# Altium schematic sheet JTAG_Configuration.SchDoc: AMC FMC Carrier v4
size 420 x 297 mm; CompanyName: WUT; Organization: WUT ISE; Address1: Warsaw University of Technology; Address2: Nowowiejska 15/19 00-665 Warsaw; Address3: t.przywozki@gmail.com; Revision: 1; SheetNumber: 9; SheetTotal: 29; Project: AMC FMC Carrier v4.0.2; ModifiedBy: F. Świtakowski; CheckedDate: -; Title2: JTAG Chain; DivGrp: ISE; Designer: T. Przywozki; ModifiedDate: -; ProjectName: ADC/DAC MEZZANINE
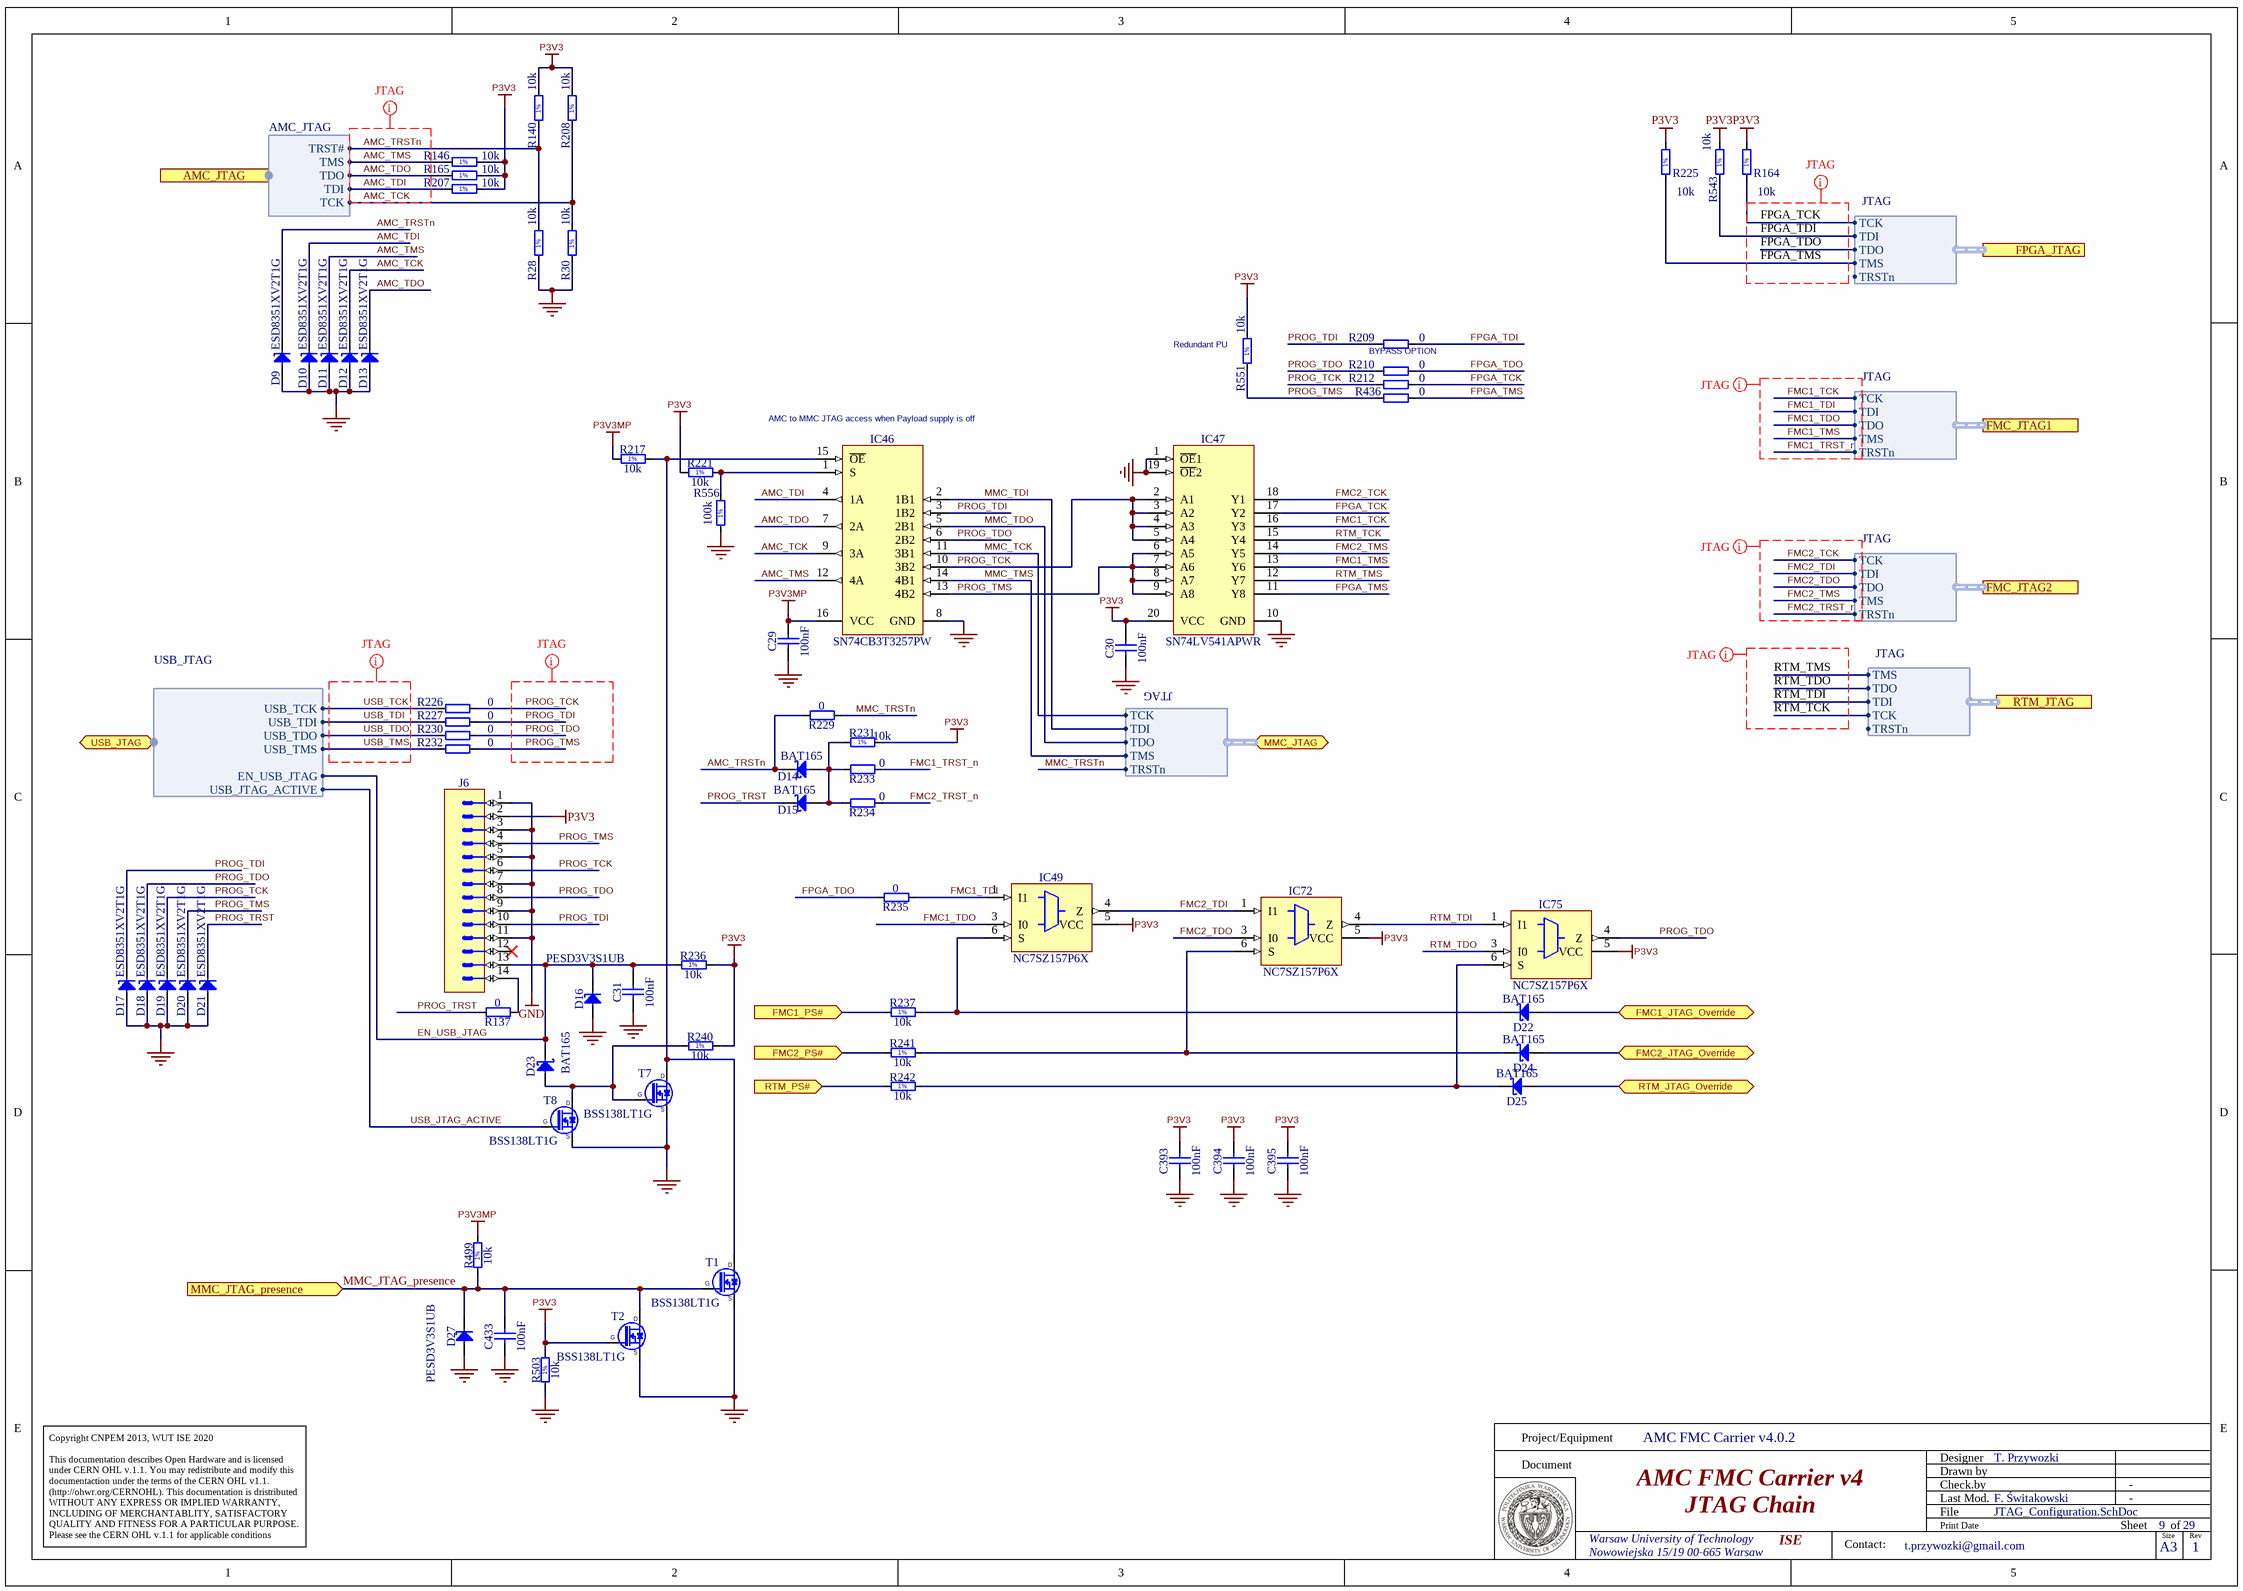
[diagram p0: JTAG_Configuration.SchDoc]

## Parts
C29  100nF  [CAPC0603X33N]
C30  100nF  [CAPC0603X33N]
C31  100nF  [CAPC1005X55N]
C393  100nF  [CAPC0603X33N]
C394  100nF  [CAPC0603X33N]
C395  100nF  [CAPC0603X33N]
C433  100nF  [CAPC1005X55N]
D9  ESD8351XV2T1G  [SODFL1608X65N]
D10  ESD8351XV2T1G  [SODFL1608X65N]
D11  ESD8351XV2T1G  [SODFL1608X65N]
D12  ESD8351XV2T1G  [SODFL1608X65N]
D13  ESD8351XV2T1G  [SODFL1608X65N]
D14  BAT165  [SOD2512X110N]
D15  BAT165  [SOD2512X110N]
D16  PESD3V3S1UB  [SODFL1608X65N]
D17  ESD8351XV2T1G  [SODFL1608X65N]
D18  ESD8351XV2T1G  [SODFL1608X65N]
D19  ESD8351XV2T1G  [SODFL1608X65N]
D20  ESD8351XV2T1G  [SODFL1608X65N]
D21  ESD8351XV2T1G  [SODFL1608X65N]
D22  BAT165  [SOD2512X110N]
D23  BAT165  [SOD2512X110N]
D24  BAT165  [SOD2512X110N]
D25  BAT165  [SOD2512X110N]
D27  PESD3V3S1UB  [SODFL1608X65N]
IC46  SN74CB3T3257PW  [SOP65P640X120-16N]
IC47  SN74LV541APWR  [SOP65P640X120-20N]
IC49  NC7SZ157P6X  [SOT65P210X110-6N]
IC72  NC7SZ157P6X  [SOT65P210X110-6N]
IC75  NC7SZ157P6X  [SOT65P210X110-6N]
J6  Milli-Grid™  [MOLEX_87832-1420]  (value not drawn)
R28  10k  [RESC1005X40N]
R30  10k  [RESC1005X40N]
R137  0  [RESC1005X40N]
R140  10k  [RESC1005X40N]
R146  10k  [RESC1005X40N]
R164  10k  [RESC1005X40N]
R165  10k  [RESC1005X40N]
R207  10k  [RESC1005X40N]
R208  10k  [RESC1005X40N]
R209  0  [RESC1005X40N]
R210  0  [RESC1005X40N]
R212  0  [RESC1005X40N]
R217  10k  [RESC1005X40N]
R221  10k  [RESC1005X40N]
R225  10k  [RESC1005X40N]
R226  0  [RESC1005X40N]
R227  0  [RESC1005X40N]
R229  0  [RESC1005X40N]
R230  0  [RESC1005X40N]
R231  10k  [RESC1005X40N]
R232  0  [RESC1005X40N]
R233  0  [RESC1005X40N]
R234  0  [RESC1005X40N]
R235  0  [RESC1005X40N]
R236  10k  [RESC1005X40N]
R237  10k  [RESC1005X40N]
R240  10k  [RESC1005X40N]
R241  10k  [RESC1005X40N]
R242  10k  [RESC1005X40N]
R436  0  [RESC1005X40N]
R499  10k  [RESC1005X40N]
R503  10k  [RESC1005X40N]
R543  10k  [RESC1005X40N]
R551  10k  [RESC1005X40N]
R556  100k  [RESC1005X40N]
T1  BSS138LT1G  [SOT95P240X110-3N]
T2  BSS138LT1G  [SOT95P240X110-3N]
T7  BSS138LT1G  [SOT95P240X110-3N]
T8  BSS138LT1G  [SOT95P240X110-3N]

## Ports
AMC_JTAG (harness AMC_JTAG), FMC1_JTAG_Override (bidir), FMC1_PS# (in), FMC2_JTAG_Override (bidir), FMC2_PS# (in), FMC_JTAG1 (harness JTAG), FMC_JTAG2 (harness JTAG), FPGA_JTAG (harness JTAG), MMC_JTAG (bidir, harness JTAG), MMC_JTAG_presence (in), RTM_JTAG (harness JTAG), RTM_JTAG_Override (bidir), RTM_PS# (in), USB_JTAG (bidir, harness USB_JTAG)

## Harnesses
AMC_JTAG: TCK, TDI, TDO, TMS, TRST#
USB_JTAG: USB_TDI, USB_TCK, USB_TMS, USB_TDO, USB_JTAG_ACTIVE, EN_USB_JTAG
JTAG: TCK, TDI, TDO, TMS, TRSTn

## Nets
GND: C29.1 C30.1 C31.1 C393.1 C394.1 C395.1 C433.1 D9.2(A) D10.2(A) D11.2(A) D12.2(A) D13.2(A) D16.2(A) D17.2(A) D18.2(A) D19.2(A) D20.2(A) D21.2(A) D27.2(A) IC46.8(GND) IC47.1(~{OE}1) IC47.10(GND) IC47.19(~{OE}2) IC49.2(GND) IC72.2(GND) IC75.2(GND) J6.1 J6.3 J6.5 J6.7 J6.9 J6.11 R28.2 R30.2 R503.1 R556.1 T1.2(S) T2.2(S) T7.2(S) T8.2(S)
P3V3: C30.2 C393.2 C394.2 C395.2 IC47.20(VCC) IC49.5(VCC) IC72.5(VCC) IC75.5(VCC) J6.2 R140.1 R146.1 R164.2 R165.1 R207.1 R208.1 R221.2 R225.2 R231.1 R236.2 R240.2 R503.2 R543.1 R551.1 T2.1(G)
P3V3MP: C29.2 IC46.16(VCC) R217.2 R499.2
AMC_TCK: D12.1(C) IC46.9(3A) R30.1 R208.2 ; port AMC_JTAG.TCK
AMC_TDI: D10.1(C) IC46.4(1A) R207.2 ; port AMC_JTAG.TDI
AMC_TDO: D13.1(C) IC46.7(2A) R165.2 ; port AMC_JTAG.TDO
AMC_TMS: D11.1(C) IC46.12(4A) R146.2 ; port AMC_JTAG.TMS
AMC_TRSTn: D9.1(C) D14.1(C) R28.1 R140.2 R229.2 ; port AMC_JTAG.TRST#
EN_USB_JTAG: C31.2 D16.1(C) D23.1(C) J6.13 R236.1 ; port USB_JTAG.EN_USB_JTAG
FMC1_JTAG_Override: D22.2(A) ; port FMC1_JTAG_Override
FMC1_PS#: R237.2 ; port FMC1_PS#
FMC1_TCK: IC47.16(Y3) ; port FMC_JTAG1.TCK
FMC1_TDI: IC49.1(I1) R235.1 ; port FMC_JTAG1.TDI
FMC1_TDO: IC49.3(I0) ; port FMC_JTAG1.TDO
FMC1_TMS: IC47.13(Y6) ; port FMC_JTAG1.TMS
FMC1_TRST_n: R233.1 ; port FMC_JTAG1.TRSTn
FMC2_JTAG_Override: D24.2(A) ; port FMC2_JTAG_Override
FMC2_PS#: R241.2 ; port FMC2_PS#
FMC2_TCK: IC47.18(Y1) ; port FMC_JTAG2.TCK
FMC2_TDI: IC49.4(Z) IC72.1(I1) ; port FMC_JTAG2.TDI
FMC2_TDO: IC72.3(I0) ; port FMC_JTAG2.TDO
FMC2_TMS: IC47.14(Y5) ; port FMC_JTAG2.TMS
FMC2_TRST_n: R234.1 ; port FMC_JTAG2.TRSTn
FPGA_TCK: IC47.17(Y2) R164.1 R212.1 ; port FPGA_JTAG.TCK
FPGA_TDI: R209.1 R543.2 ; port FPGA_JTAG.TDI
FPGA_TDO: R210.1 R235.2 ; port FPGA_JTAG.TDO
FPGA_TMS: IC47.11(Y8) R225.1 R436.1 ; port FPGA_JTAG.TMS
MMC_JTAG_presence: C433.2 D27.1(C) R499.1 T1.1(G) T2.3(D) ; port MMC_JTAG_presence
MMC_TCK: IC46.11(3B1) ; port MMC_JTAG.TCK
MMC_TDI: IC46.2(1B1) ; port MMC_JTAG.TDI
MMC_TDO: IC46.5(2B1) ; port MMC_JTAG.TDO
MMC_TMS: IC46.14(4B1) ; port MMC_JTAG.TMS
MMC_TRSTn: R229.1 ; port MMC_JTAG.TRSTn
PROG_TCK: D19.1(C) IC46.10(3B2) IC47.2(A1) IC47.3(A2) IC47.4(A3) IC47.5(A4) J6.6 R212.2 R226.1
PROG_TDI: D17.1(C) IC46.3(1B2) J6.10 R209.2 R227.1
PROG_TDO: D18.1(C) IC46.6(2B2) IC75.4(Z) J6.8 R210.2 R230.1
PROG_TMS: D20.1(C) IC46.13(4B2) IC47.6(A5) IC47.7(A6) IC47.8(A7) IC47.9(A8) J6.4 R232.1 R436.2 R551.2
PROG_TRST: D15.1(C) D21.1(C) R137.2
RTM_JTAG_Override: D25.2(A) ; port RTM_JTAG_Override
RTM_PS#: R242.2 ; port RTM_PS#
RTM_TCK: IC47.15(Y4) ; port RTM_JTAG.TCK
RTM_TDI: IC72.4(Z) IC75.1(I1) ; port RTM_JTAG.TDI
RTM_TDO: IC75.3(I0) ; port RTM_JTAG.TDO
RTM_TMS: IC47.12(Y7) ; port RTM_JTAG.TMS
USB_JTAG_ACTIVE: T8.1(G) ; port USB_JTAG.USB_JTAG_ACTIVE
USB_TCK: R226.2 ; port USB_JTAG.USB_TCK
USB_TDI: R227.2 ; port USB_JTAG.USB_TDI
USB_TDO: R230.2 ; port USB_JTAG.USB_TDO
USB_TMS: R232.2 ; port USB_JTAG.USB_TMS
NetD14_2: D14.2(A) D15.2(A) R231.2 R233.2 R234.2
NetD22_1: D22.1(C) IC49.6(S) R237.1
NetD23_2: D23.2(A) R240.1 T7.1(G) T8.3(D)
NetD24_1: D24.1(C) IC72.6(S) R241.1
NetD25_1: D25.1(C) IC75.6(S) R242.1
NetIC46_1: IC46.1(S) R221.1 R556.2
NetIC46_15: IC46.15(~{OE}) R217.1 T1.3(D) T7.3(D)
NetJ6_14: J6.14 R137.1

Not connected (* = marked no-connect by the designer): J6 12*

## Layout directives
net class JTAG: AMC_TCK, AMC_TDI, AMC_TDO, AMC_TMS, AMC_TRSTn, FMC1_TCK, FMC1_TDI, FMC1_TDO, FMC1_TMS, FMC1_TRST_n, FMC2_TCK, FMC2_TDI, FMC2_TDO, FMC2_TMS, FMC2_TRST_n, FPGA_TCK, FPGA_TDI, FPGA_TDO, FPGA_TMS, PROG_TCK, PROG_TDI, PROG_TDO, PROG_TMS, RTM_TCK, RTM_TDI, RTM_TDO, RTM_TMS, USB_TCK, USB_TDI, USB_TDO, USB_TMS

## Notes on the sheet
- (near R551) Redundant PU
- (near R209) BYPASS OPTION
- (near IC46) AMC to MMC JTAG access when Payload supply is off
- Project/Equipment
- Document
- Designer
- Drawn by
- Check.by
- Copyright CNPEM 2013, WUT ISE 2020
  This documentation describes Open Hardware and is licensed under CERN OHL v.1.1. You may redistribute and modify this documentaction under the terms of the CERN OHL v1.1.
  (http://ohwr.org/CERNOHL). This documentation is dristributed WITHOUT ANY EXPRESS OR IMPLIED WARRANTY, INCLUDING OF MERCHANTABLITY, SATISFACTORY QUALITY AND FITNESS FOR A PARTICULAR PURPOSE. Please see the CERN OHL v.1.1 for applicable conditions
- File
- Last Mod.
- Print Date
- Sheet
- Size
- A3
- of
- Rev
- Contact:
- (in symbol R0402_10K_1%_0.0625W_100PPM) 1%
- (in symbol R0402_100K_1%_0.0625W_100PPM) 1%

## Library data of the parts
C29 C30 C393-C395 = CC0201_100NF_6.3V_10%_X5R: Non-polarised capacitor; Manufacturer: GENERIC; Part Description: SMD Multilayer Chip Ceramic Capacitor; Manufacturer1 Part Number: 02016D104KAT2A; Tolerance: ±10%; Voltage: 6.3V; TC: X5R; Manufacturer Part Number: CC0201_100NF_6.3V_10%_X5R; Part Number: CC0201_100NF_6.3V_10%_X5R; Value: 100nF; Component Kind: Standard; Component Type: Standard; Pin Count: 2; Status: Not Recommended; Case: 0201; Mounted: Yes; Socket: No; SMD: Yes; Sense: No; Manufacturer1 Example: AVX; Manufacturer1 ComponentHeight: 0.33mm; HelpURL: \\cern.ch\dfs\Applications\Altium\Datasheets\CC0201_X5R_AVX.pdf; Author: CERN DEM JLC; CreateDate: 03.12.2007; LatestRevisionDate: 03.12.2007
C31 C433 = CC0402_100NF_16V_10%_X5R: Non-polarised capacitor; Manufacturer: GENERIC; Part Description: SMD Multilayer Chip Ceramic Capacitor; Manufacturer1 Part Number: GRM155R61C104KA88D; Tolerance: ±10%; Voltage: 16V; TC: X5R; Manufacturer Part Number: CC0402_100NF_16V_10%_X5R; Part Number: CC0402_100NF_16V_10%_X5R; Value: 100nF; Component Kind: Standard; Component Type: Standard; Pin Count: 2; Status: None; Case: 0402; Mounted: Yes; Socket: No; SMD: Yes; Sense: No; Manufacturer1 Example: MURATA; Manufacturer1 ComponentHeight: 0.55mm; HelpURL: \\cern.ch\dfs\Applications\Altium\Datasheets\CC0402_X5R_MURATA_GRM.pdf; Author: CERN DEM JLC; CreateDate: 10.12.2013; LatestRevisionDate: 10.12.2013
D9-D13 D16-D21 D27 = PESD3V3S1UB: ESD protection diode; Manufacturer: NXP SEMICONDUCTORS; Part Description: ESD protection diode (23kV); Voltage: 3V3; Power: 330W; PressFit: No; Bonding: No; PackageDescription: Ultra Small Outline Diode Flat Lead (SOD-523), Body; 1.2mm L X 0.8mm W X 0.65mm H, IPC Medium Density; Component Kind: Standard; Component Type: Standard; Pin Count: 2; Case: SOD523; Mounted: Yes; Socket: No; SMD: Yes; Sense: No; ComponentHeight: 0.65mm; HelpURL: \\cern.ch\dfs\Applications\Altium\Datasheets\PESD3V3S1UB.pdf; Author: CERN DEM JLC; CreateDate: 29.11.2012; LatestRevisionDate: 29.11.2012
  D9-D13 D17-D21: Manufacturer Part Number: ESD8351XV2T1G; Part Number: ESD8351XV2T1G; Device: ESD8351XV2T1G
  D16 D27: Manufacturer Part Number: PESD3V3S1UB; Part Number: PESD3V3S1UB; Device: PESD3V3S1UB
D14 D15 D22-D25 = BAT165: Schottky Diode; Manufacturer: INFINEON; Part Description: Medium Power AF Schottky Diode; Voltage: 40V; Power: 750mA; PressFit: No; Bonding: No; Manufacturer Part Number: BAT165; PackageDescription: Small Outline Diode (SOD-323), 1.70mm W X 1.25mm L X 1.10mm H body,  IPC Medium Density; Part Number: BAT165; Component Kind: Standard; Component Type: Standard; Device: BAT165; Pin Count: 2; Case: SOD323; Mounted: Yes; Socket: No; SMD: Yes; Sense: No; ComponentHeight: 1.1mm; HelpURL: \\cern.ch\dfs\Applications\Altium\Datasheets\BAT165.pdf; Author: CERN DEM JLC; CreateDate: 12.11.2014; LatestRevisionDate: 12.11.2014
IC46 = SN74CB3T3257PW: 4-BIT 1-OF-2 FET Multiplexer/Demultiplexer 2.5V/3.3V Low-Voltage Bus Switch 5V Tolerant Shifter; Manufacturer: TEXAS INSTRUMENTS; PressFit: No; Bonding: No; Manufacturer Part Number: SN74CB3T3257PW; PackageDescription: SOP, 0.65mm pitch; 16 pin, 4.40mm W X 5.00mm L X 1.20mm H body IPC Medium Density; Part Description: 4-Bit 1-of-2 FET Multiplexer/Demultiplexer 2.5V/3.3V Low-Voltage Bus Switch 5V Tolerant Shifter; Part Number: SN74CB3T3257PW; Component Kind: Standard; Component Type: Standard; Device: SN74CB3T3257PW; Pin Count: 16; Case: TSSOP16; Mounted: Yes; Socket: No; SMD: Yes; Sense: No; ComponentHeight: 1.2mm; Author: CERN DEM JLC; HelpURL: \\cern.ch\dfs\Applications\Altium\Datasheets\SN74CB3T3257PW.pdf; CreateDate: 30.01.2012; LatestRevisionDate: 30.01.2012
IC47 = SN74LV541APWR: Octal Buffer/Line Driver with 3-State Outputs; Manufacturer: TEXAS INSTRUMENTS; Part Description: Octal Bus Transceiver/Driver with 3-State Outputs; PressFit: No; Bonding: No; Manufacturer Part Number: SN74LV541APWR; PackageDescription: SOP, 20-Leads, Body 6.5x4.4mm, Pitch 0.65mm, IPC Medium Density; Part Number: SN74LV541APWR; Component Kind: Standard; Component Type: Standard; Device: SN74LV541APWR; Pin Count: 20; Case: TSSOP20; Mounted: Yes; Socket: No; SMD: Yes; Sense: No; ComponentHeight: 1.2mm; Author: CERN DEM JLC; HelpURL: \\cern.ch\dfs\Applications\Altium\Datasheets\SN74LV541APWR.pdf; CreateDate: 07.07.2014; LatestRevisionDate: 07.07.2014
IC49 IC72 IC75 = NC7SZ157P6X: TinyLogic® UHS 2-Input Non-Inverting Multiplexer; Manufacturer: FAIRCHILD SEMICONDUCTOR; PressFit: No; Bonding: No; Manufacturer Part Number: NC7SZ157P6X; PackageDescription: SOT363, 0.65mm pitch; 6 pin, 1.40mm W X 2.15mm L, IPC Medium Density; Part Description: TinyLogic® UHS 2-Input Non-Inverting Multiplexer; Part Number: NC7SZ157P6X; Component Kind: Standard; Component Type: Standard; Device: NC7SZ157P6X; Pin Count: 6; Case: SOT363; Mounted: Yes; Socket: No; SMD: Yes; Sense: No; ComponentHeight: 1.1mm; Author: CERN DEM JLC; HelpURL: \\cern.ch\dfs\Applications\Altium\Datasheets\NC7SZ157P6X.pdf; CreateDate: 22.03.2012; LatestRevisionDate: 22.03.2012
J6 = MOLEX_87832-1420: Connector 14 Male; Part Description: 2.00mm (.079") Pitch Milli-Grid™ Header, Surface Mount, Vertical, Shrouded, 14 Circuits,with Locking Windows and Centre Polarization Slot, PCB Locator; Manufacturer: MOLEX; Part Number: MOLEX_87832-1420; Component Kind: Standard; Component Type: Standard; Pin Count: 14; Family: Milli-Grid™; Mounted: Yes; Socket: No; SMD: Yes; Status: None; Manufacturer Part Number: 87832-1420; ComponentHeight: 6.4mm; HelpURL: \\cern.ch\dfs\Applications\Altium\Datasheets\MOLEX_87832-1420.pdf; Author: CERN DEM JLC; CreateDate: 2008-09-09; LatestRevisionDate: 2008-09-09; Table: MOLEX
R28 R30 R140 R146 R165 R207 R208 R217 R221 R231 R236 R237 R240-R242 R499 R503 R543 R551 = R0402_10K_1%_0.0625W_100PPM: Resistor - 1%; Manufacturer: GENERIC; Part Description: General Purpose Thick Film Chip Resistor; Manufacturer1 Part Number: 232270671003L; TC: ±100ppm/°C; PressFit: No; Manufacturer Part Number: R0402_10K_1%_0.0625W_100PPM; Part Number: R0402_10K_1%_0.0625W_100PPM; Tolerance: ±1%; Value: 10k; Component Kind: Standard; Component Type: Standard; Pin Count: 2; Status: Not Recommended; Power: 0.0625W; Case: 0402; Mounted: Yes; Sense: No; Socket: No; SMD: Yes; Manufacturer1 Example: YAGEO PHYCOMP; Manufacturer1 ComponentHeight: 0.4mm; HelpURL: \\cern.ch\dfs\Applications\Altium\Datasheets\R0402_Phycomp_RC0402.pdf; Author: CERN DEM JLC; CreateDate: 03.12.2007; LatestRevisionDate: 17.10.2012
R137 R209 R210 R212 R226 R227 R229 R230 R232-R235 R436 = R0402_0R_JUMPER: Resistor; Manufacturer: GENERIC; Part Description: 1A (0.05R Max DC Resistance) Zero Ohm Jumper; Manufacturer1 Part Number: 232270591001L; PressFit: No; Manufacturer Part Number: R0402_0R_JUMPER; Part Number: R0402_0R_JUMPER; Value: 0; Component Kind: Standard; Component Type: Standard; Pin Count: 2; Status: Not Recommended; Case: 0402; Mounted: Yes; Sense: No; Socket: No; SMD: Yes; Manufacturer1 Example: YAGEO PHYCOMP; Manufacturer1 ComponentHeight: 0.4mm; HelpURL: \\cern.ch\dfs\Applications\Altium\Datasheets\R0402_Phycomp_RC0402.pdf; Author: CERN DEM JLC; CreateDate: 03.12.2007; LatestRevisionDate: 17.10.2012
R164 R225 = R0402_10K_1%_0.0625W_100PPM: Resistor - 1%; Part Description: General Purpose Thick Film Chip Resistor; Manufacturer: GENERIC; Manufacturer1 Part Number: 232270671003L; TC: ±100ppm/°C; Table: Resistors SMD; Part Number: R0402_10K_1%_0.0625W_100PPM; Component Kind: Standard; Component Type: Standard; Pin Count: 2; Value: 10k; Status: Not recommended; Power: 0.0625W; Tolerance: ±1%; Manufacturer Part Number: R0402_10K_1%_0.0625W_100PPM; Case: 0402; Mounted: Yes; Socket: No; SMD: Yes; Manufacturer1 Example: YAGEO PHYCOMP; Manufacturer1 ComponentHeight: 0.4mm; HelpURL: \\cern.ch\dfs\Applications\Altium\Datasheets\R0402_Phycomp_RC0402.pdf; Author: CERN DEM JLC; CreateDate: 2007-12-03; LatestRevisionDate: 2012-10-17
R556 = R0402_100K_1%_0.0625W_100PPM: Resistor - 1%; Part Description: General Purpose Thick Film Chip Resistor; Manufacturer: GENERIC; Manufacturer1 Part Number: 232270671004L; TC: ±100ppm/°C; Table: Resistors SMD; Part Number: R0402_100K_1%_0.0625W_100PPM; Component Kind: Standard; Component Type: Standard; Pin Count: 2; Value: 100k; Status: Not recommended; Power: 0.0625W; Tolerance: ±1%; Manufacturer Part Number: R0402_100K_1%_0.0625W_100PPM; Case: 0402; Mounted: Yes; Socket: No; SMD: Yes; Manufacturer1 Example: YAGEO PHYCOMP; Manufacturer1 ComponentHeight: 0.4mm; HelpURL: \\cern.ch\dfs\Applications\Altium\Datasheets\R0402_Phycomp_RC0402.pdf; Author: CERN DEM JLC; CreateDate: 2007-12-03; LatestRevisionDate: 2012-10-17
T1 T2 T7 T8 = BSS138LT1G: N-CHANNEL MOSFET WITH DIODE; Manufacturer: ON SEMICONDUCTOR; Part Description: 50V 200mA N-Channel Enhancement Mode Field-Effect Transistor; PressFit: No; Bonding: No; Manufacturer Part Number: BSS138LT1G; PackageDescription: SOT23 3-Leads, Pitch 0.95mm - Body 1.4x3mm, IPC Medium Density; Part Number: BSS138LT1G; Component Kind: Standard; Component Type: Standard; Device: BSS138LT1G; Pin Count: 3; Case: SOT23-3; Mounted: Yes; Socket: No; SMD: Yes; Sense: No; ComponentHeight: 1.11mm; HelpURL: \\cern.ch\dfs\Applications\Altium\Datasheets\BSS138LT1G.pdf; Author: CERN DEM JLC; CreateDate: 23.03.2009; LatestRevisionDate: 23.03.2009